# EAGLE schematic coil_accelerator (EAGLE 8.7.0)
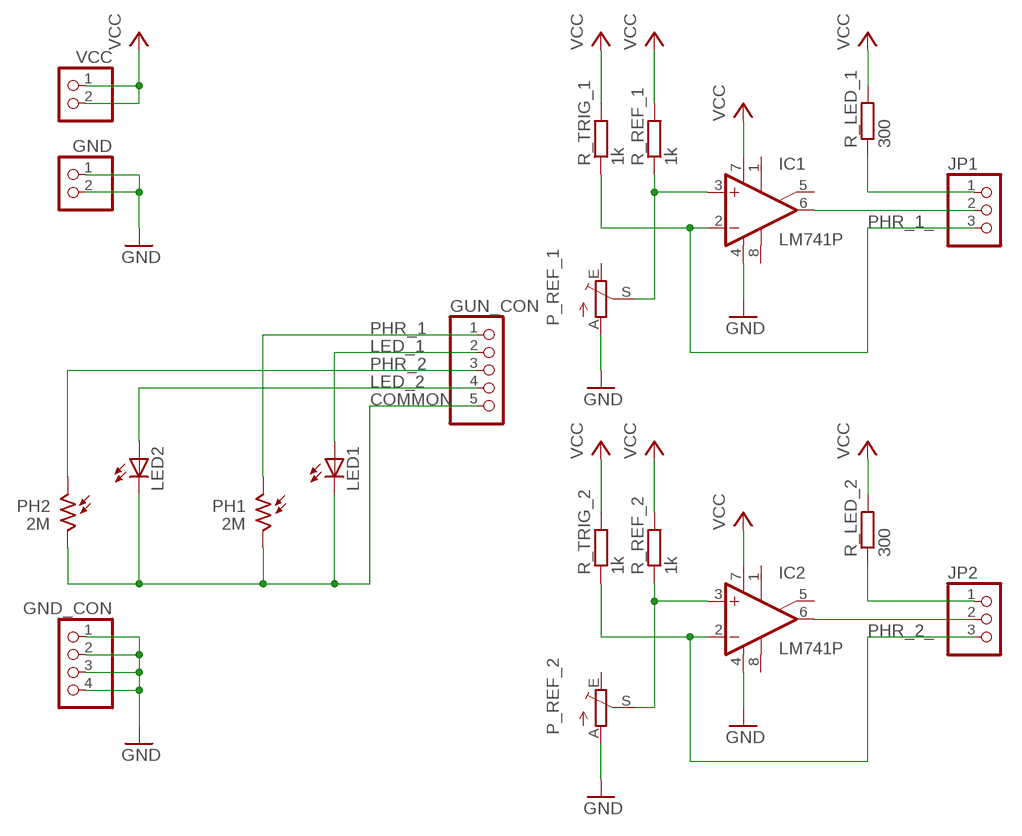
[diagram p0: schematic, sheet 1]

## Parts
GND  PINHD-1X2  [1X02]
GND_CON  PINHD-1X4  [1X04]
GUN_CON  PINHD-1X5  [1X05]
IC1  LM741P  [DIL08]
IC2  LM741P  [DIL08]
JP1  PINHD-1X3  [1X03]
JP2  PINHD-1X3  [1X03]
LED1  LED5MM  [LED5MM]
LED2  LED5MM  [LED5MM]
P_REF_1  TRIM_EU-RJ9W  [RJ9W]
P_REF_2  TRIM_EU-RJ9W  [RJ9W]
PH1  2M  A1050_09  [T0-46-A10XX]
PH2  2M  A1050_09  [T0-46-A10XX]
R_LED_1  300  R-EU_0207/10  [0207/10]
R_LED_2  300  R-EU_0207/10  [0207/10]
R_REF_1  1k  R-EU_0207/10  [0207/10]
R_REF_2  1k  R-EU_0207/10  [0207/10]
R_TRIG_1  1k  R-EU_0207/10  [0207/10]
R_TRIG_2  1k  R-EU_0207/10  [0207/10]
VCC  PINHD-1X2  [1X02]

## Nets
COMMON: GUN_CON.5 LED1.K(C) LED2.K(C) PH1.2 PH2.2
GND: GND.1 GND.2 GND_CON.1 GND_CON.2 GND_CON.3 GND_CON.4 IC1.4(V-) IC2.4(V-) P_REF_1.A P_REF_2.A
LED_1: GUN_CON.2 LED1.A
LED_2: GUN_CON.4 LED2.A
N$1: JP1.1 R_LED_1.1
N$2: IC1.6(OUT) JP1.2
N$3: IC1.3(+IN) P_REF_1.S R_REF_1.1
N$4: JP2.1 R_LED_2.1
N$5: IC2.6(OUT) JP2.2
N$6: IC2.3(+IN) P_REF_2.S R_REF_2.1
PHR_1: GUN_CON.1 PH1.1
PHR_1_: IC1.2(-IN) JP1.3 R_TRIG_1.1
PHR_2: GUN_CON.3 PH2.1
PHR_2_: IC2.2(-IN) JP2.3 R_TRIG_2.1
VCC: IC1.7(V+) IC2.7(V+) R_LED_1.2 R_LED_2.2 R_REF_1.2 R_REF_2.2 R_TRIG_1.2 R_TRIG_2.2 VCC.1 VCC.2
Unconnected: IC1.1(ON1) IC1.5(ON2) IC1.8(OPT) IC2.1(ON1) IC2.5(ON2) IC2.8(OPT) P_REF_1.E P_REF_2.E

## Library data of the parts
GND VCC = pinhead:PINHD-1X2: PIN HEADER
GND_CON = pinhead:PINHD-1X4: PIN HEADER
GUN_CON = pinhead:PINHD-1X5: PIN HEADER
IC1 IC2 = linear:*741: OP AMP
JP1 JP2 = pinhead:PINHD-1X3: PIN HEADER
LED1 LED2 = led:LED: LED OSRAM: - CHIPLED LG R971, LG N971, LY N971, LG Q971, LY Q971, LO R971, LY R971 LH N974, LH R974 LS Q976, LO Q976, LY Q976 LO Q996 - Hyper CHIPLED LW Q18S LB Q993, LB Q99A, LB R99A - SideLED LS A670, LO A670, LY A670, LG A670, LP A670 LB A673, LV A673, LT A673, LW A673 LH A674 LY A675 LS A676, LA A676, LO A676, LY A676, LW A676 LS A679, LY A679, LG A679 - Hyper Micro SIDELED® LS Y876, LA Y876, LO Y876, LY Y876 LT Y87S - SmartLED LW L88C, LW L88S LB L89C, LB L89S, LG L890 LS L89K, LO L89K, LY L89K LS L896, LA L896, LO L896, LY L896 - TOPLED LS T670, LO T670, LY T670, LG T670, LP T670 LSG T670, LSP T670, LSY T670, LOP T670, LYG T670 LG T671, LOG T671, LSG T671 LB T673, LV T673, LT T673, LW T673 LH T674 LS T676, LA T676, LO T676, LY T676, LB T676, LH T676, LSB T676, LW T676 LB T67C, LV T67C, LT T67C, LS T67K, LO T67K, LY T67K, LW E67C LS E67B, LA E67B, LO E67B, LY E67B, LB E67C, LV E67C, LT E67C LW T67C LS T679, LY T679, LG T679 LS T770, LO T770, LY T770, LG T770, LP T770 LB T773, LV T773, LT T773, LW T773 LH T774 LS E675, LA E675, LY E675, LS T675 LS T776, LA T776, LO T776, LY T776, LB T776 LHGB T686 LT T68C, LB T68C - Hyper Mini TOPLED® LB M676 - Mini TOPLED Santana® LG M470 LS M47K, LO M47K, LY M47K Source: http://www.osram.convergy.de LUXEON: - LUMILED® LXK2-PW12-R00, LXK2-PW12-S00, LXK2-PW14-U00, LXK2-PW14-V00 LXK2-PM12-R00, LXK2-PM12-S00, LXK2-PM14-U00 LXK2-PE12-Q00, LXK2-PE12-R00, LXK2-PE12-S00, LXK2-PE14-T00, LXK2-PE14-U00 LXK2-PB12-K00, LXK2-PB12-L00, LXK2-PB12-M00, LXK2-PB14-N00, LXK2-PB14-P00, LXK2-PB14-Q00 LXK2-PR12-L00, LXK2-PR12-M00, LXK2-PR14-Q00, LXK2-PR14-R00 LXK2-PD12-Q00, LXK2-PD12-R00, LXK2-PD12-S00 LXK2-PH12-R00, LXK2-PH12-S00 LXK2-PL12-P00, LXK2-PL12-Q00, LXK2-PL12-R00 Source: www.luxeon.com KINGBRIGHT: KA-3528ASYC Source: www.kingbright.com
P_REF_1 P_REF_2 = pot:TRIM_EU-: POTENTIOMETER
PH1 PH2 = photo-elements:A10: Sensor Robust Light Sensing Applications Outdoor Light Sensing Application Source: http://optoelectronics.perkinelmer.com/content/Datasheets/DTS_PhotocellsA1050.pdf
R_LED_1 R_LED_2 R_REF_1 R_REF_2 R_TRIG_1 R_TRIG_2 = rcl:R-EU_: RESISTOR, European symbol; SPICEPREFIX: R